# EasyEDA schematic first.json
TITLE: Sheet_1; REV: 1.0; Date: 2024-08-19; Sheet: 1/1; Drawn By: shinjan; Company: Your Company
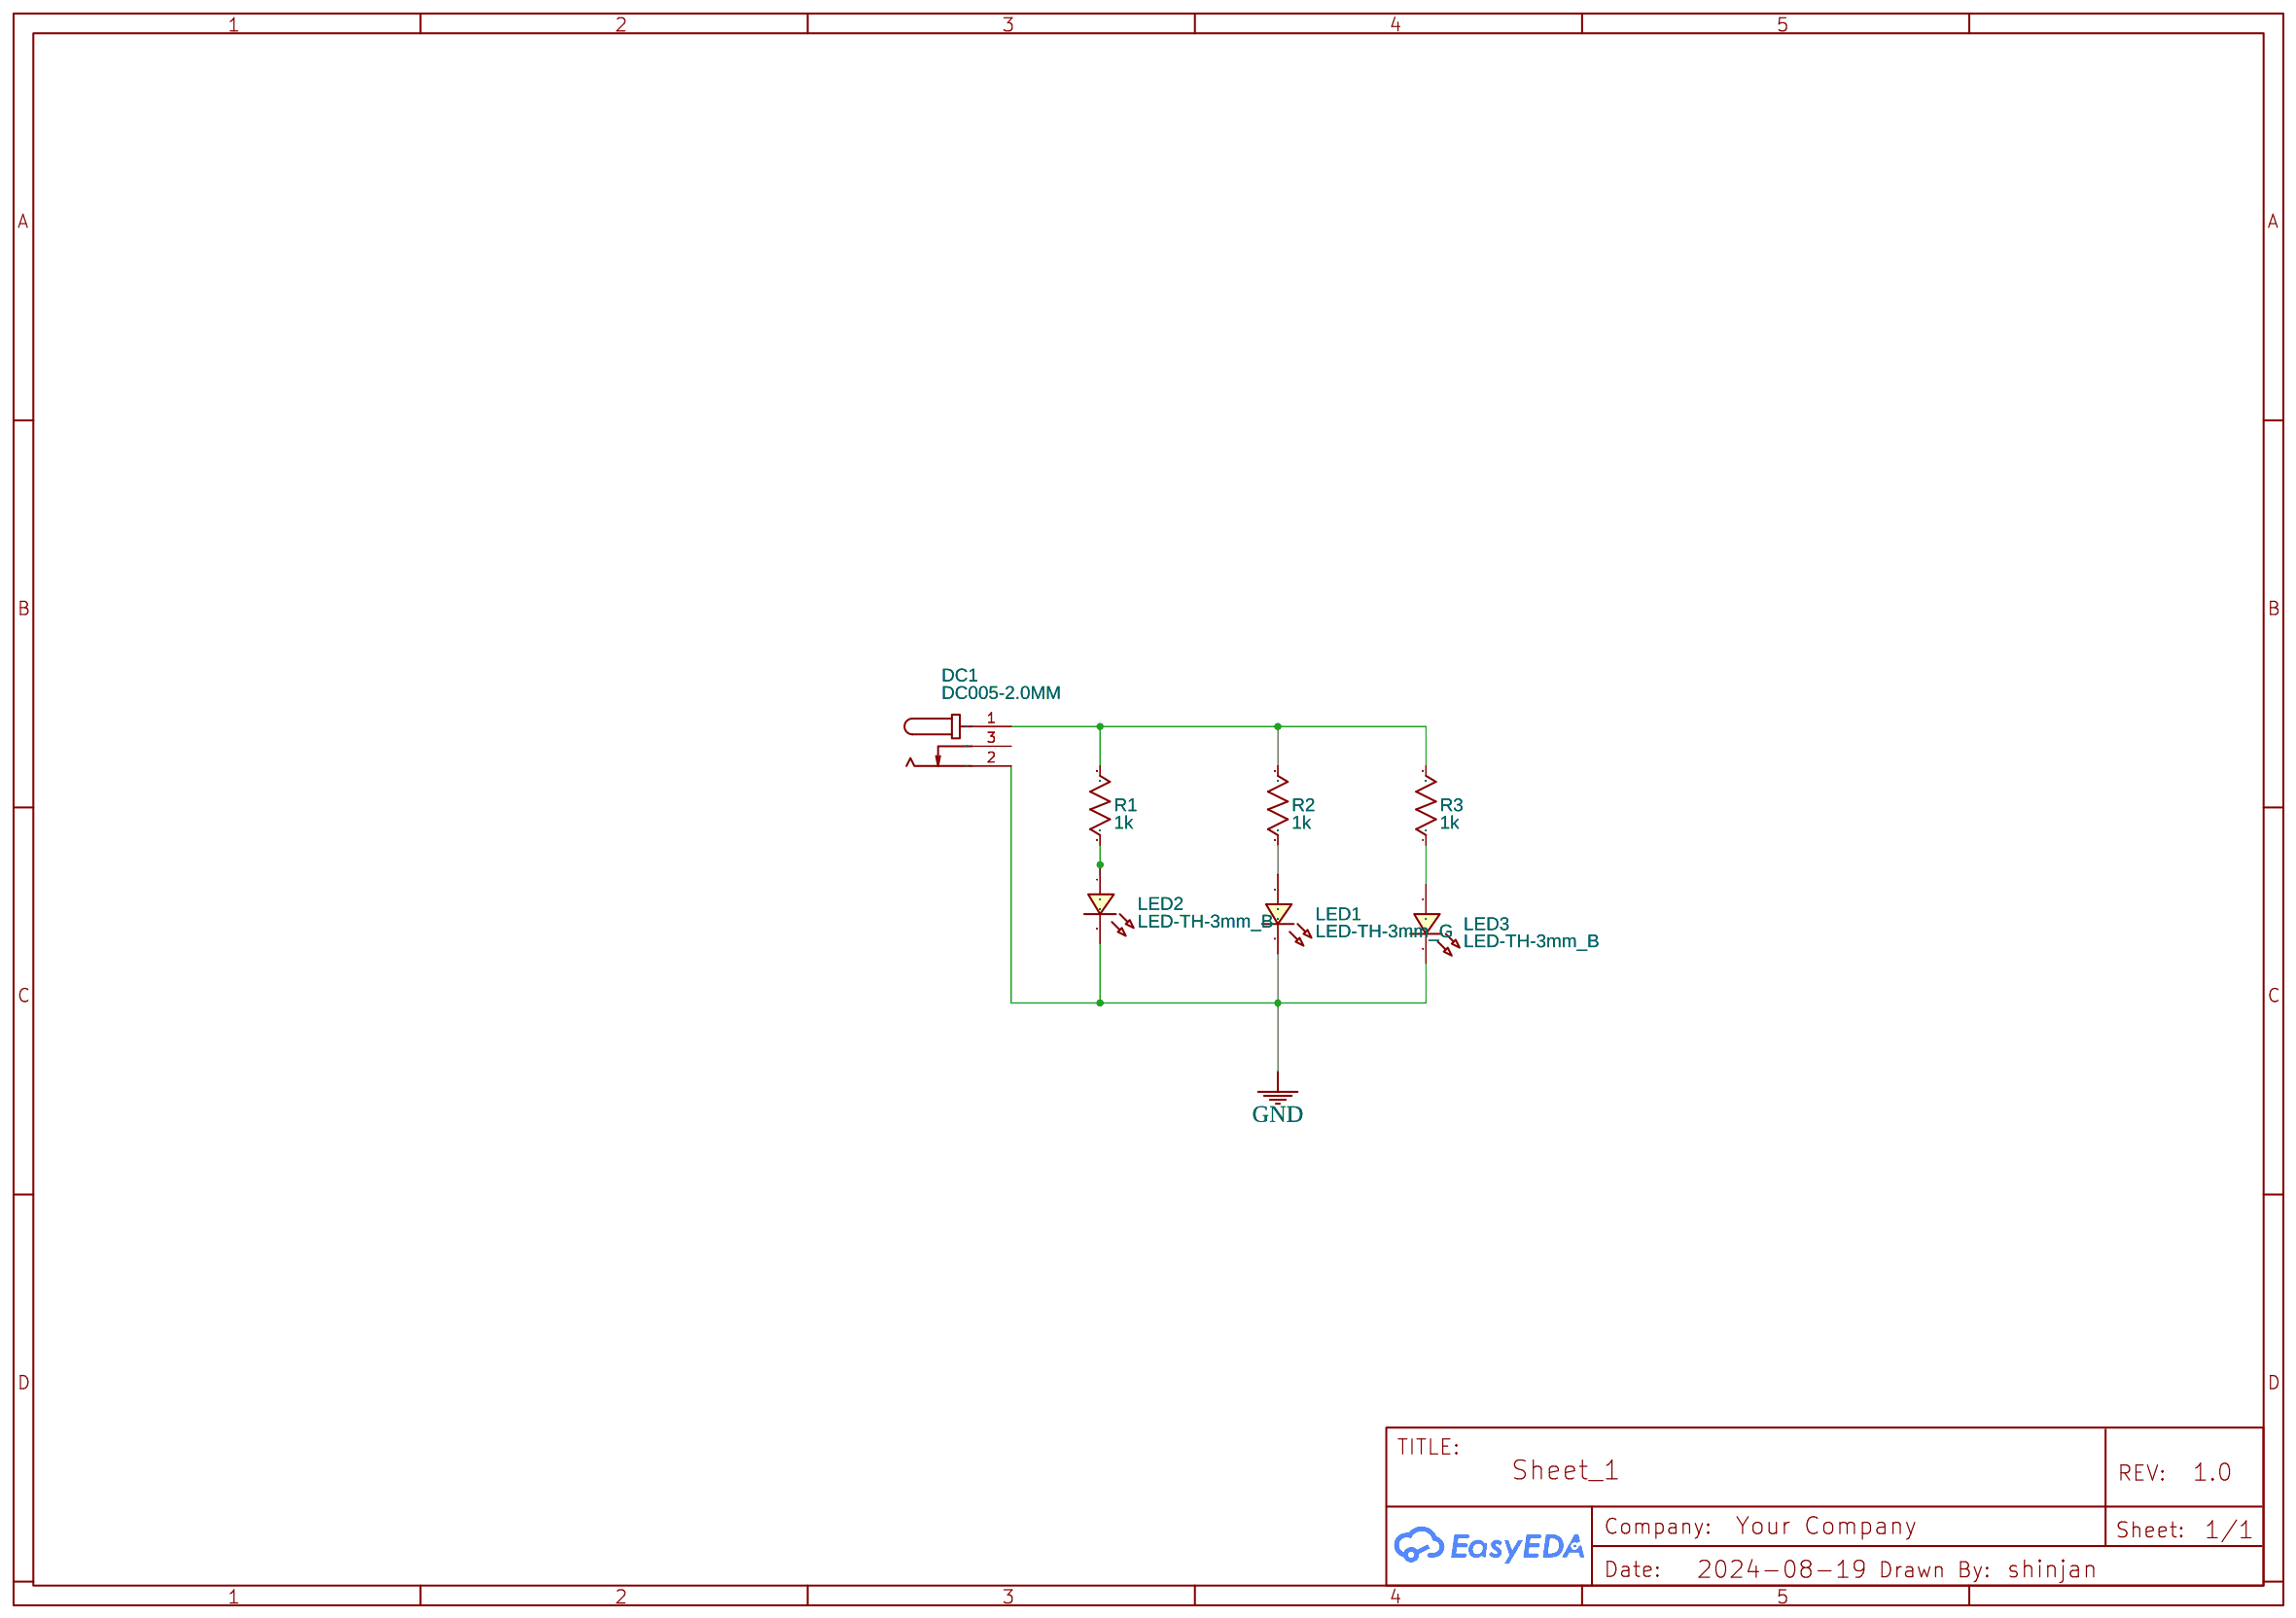
[diagram p0: schematic sheet]

## Parts
DC1  DC005-2.0MM  [DC-IN-TH_DC005]
LED1  LED-TH-3mm_G  [LED-TH_BD3.0_GREEN]
LED2  LED-TH-3mm_B  [LED-TH_BD3.0_BLUE]
LED3  LED-TH-3mm_B  [LED-TH_BD3.0_BLUE]
R1  1k  [R0603]
R2  1k  [R0603]
R3  1k  [R0603]

## Library data of the parts
DC1 = DC005-2.0MM: Supplier: LCSC; Manufacturer: SOFNG; Supplier Part: C111567
LED1 = LED-TH-3mm_G: Manufacturer: EVERLIGHT(台湾亿光); Manufacturer Part: 204-10SYGD/S530-E3; Supplier Part: C85161; Contributor: LCEDA_Lib
LED2 LED3 = LED-TH-3mm_B: Manufacturer: EVERLIGHT(台湾亿光); Manufacturer Part: 204-10SUBC/S400-A4; Supplier Part: C86881; Supplier: LCSC; Contributor: LCEDA_Lib
R1-R3 = R_0603_US: Supplier Part: C3482538; Supplier: LCSC; Contributor: LCEDA_Lib; Manufacturer Part: MFR-25FRF52-130R; Manufacturer: YAGEO(国巨)

## Nets
GND: DC1.2 LED1.2 LED2.2 LED3.2
Net-(DC1-1): DC1.1 R1.2 R2.2 R3.2
Net-(LED1-1): LED1.1 R2.1
Net-(LED2-1): LED2.1 R1.1
Net-(LED3-1): LED3.1 R3.1

Not connected (* = marked no-connect by the designer): DC1 3
